# Altium schematic sheet Sheet_1_2025-08-10.schdoc
size 307 x 219 mm
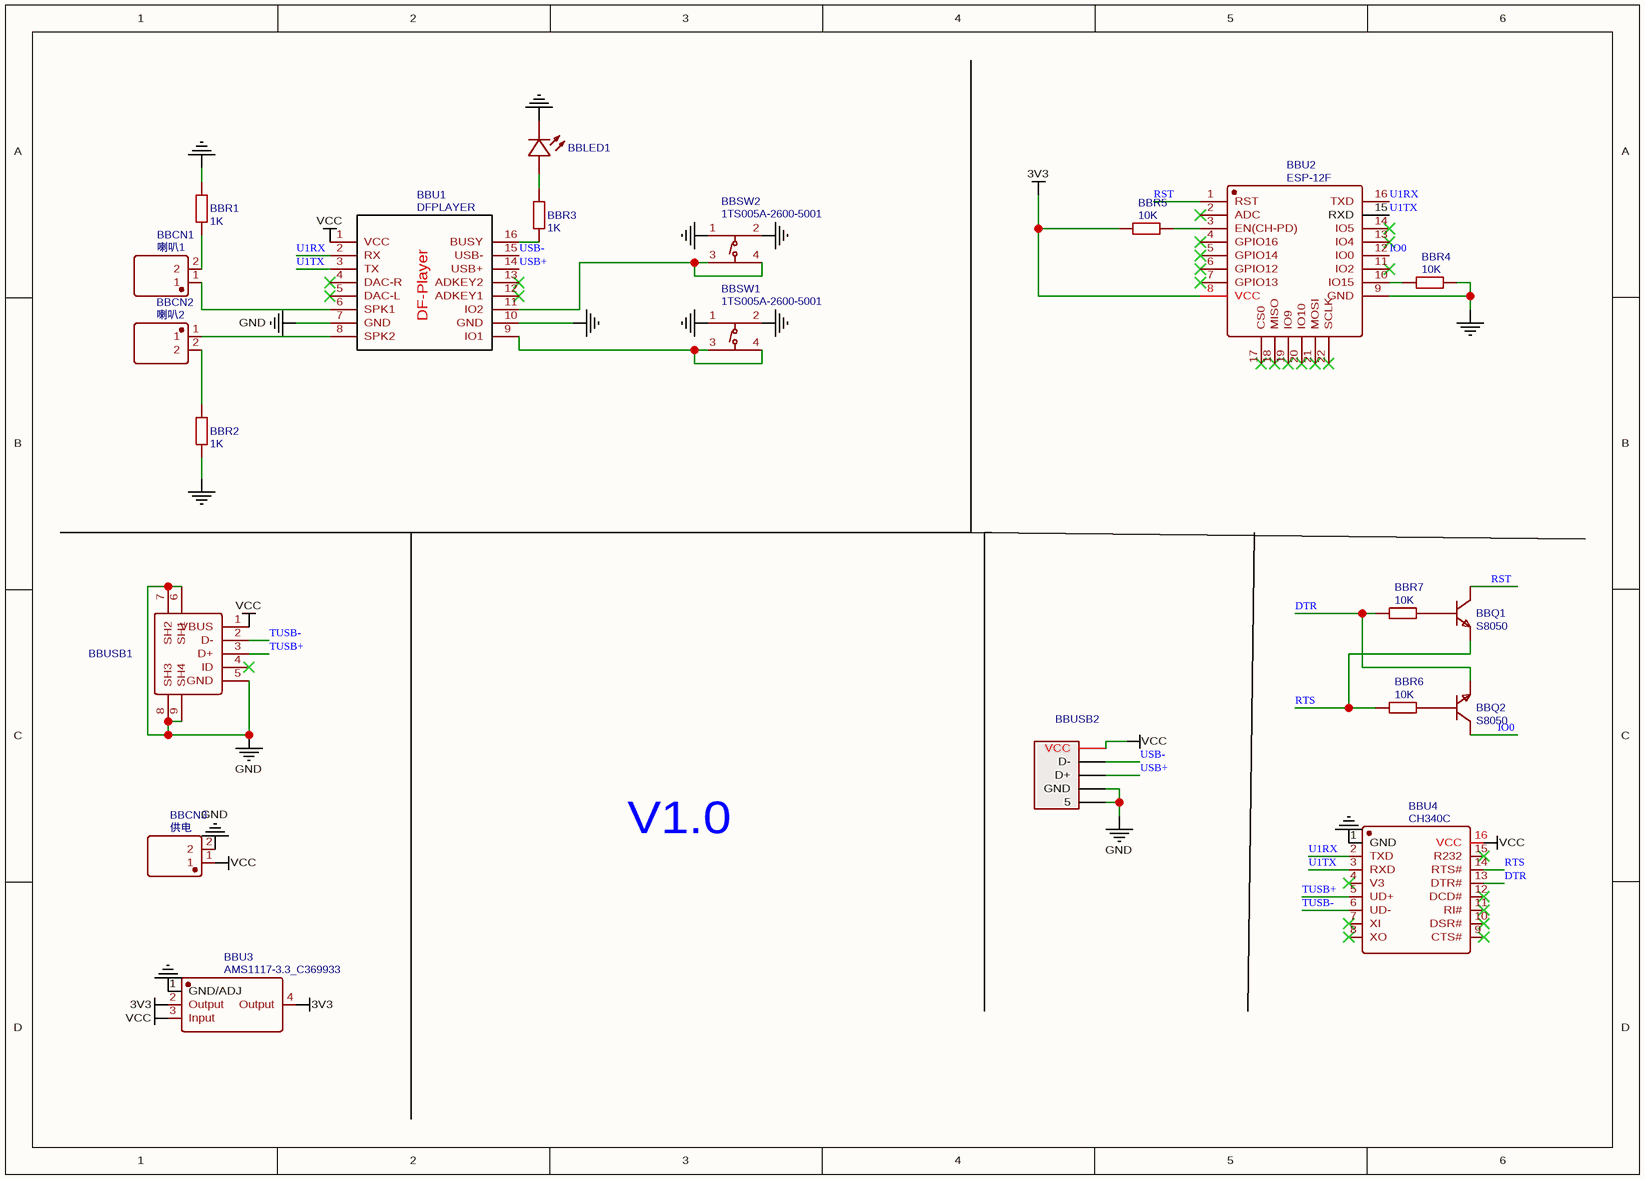
[diagram p0: Sheet_1_2025-08-10.schdoc]

## Parts
BBCN1  喇叭1  [XH2.54-2AW]
BBCN2  喇叭2  [XH2.54-2AW]
BBCN3  供电  [XH2.54-2AW]
BBLED1  FC-2012WBY-460G  [LED0805-RD]  (value not drawn)
BBQ1  S8050  [SOT-23-3_L2.9-W1.3-P1.90-LS2.4-BR]
BBQ2  S8050  [SOT-23-3_L2.9-W1.3-P1.90-LS2.4-BR]
BBR1  1K  [R0805]
BBR2  1K  [R0805]
BBR3  1K  [R0805]
BBR4  10K  [R0805]
BBR5  10K  [R0805]
BBR6  10K  [R0805]
BBR7  10K  [R0805]
BBSW1  1TS005A-2600-5001  [SW-TH_4P-L6.0-W6.0-P4.50-LS6.5]
BBSW2  1TS005A-2600-5001  [SW-TH_4P-L6.0-W6.0-P4.50-LS6.5]
BBU1  DFPLAYER  [DFPLAYER]
BBU2  ESP-12F  [ESP12F简版]
BBU3  AMS1117-3.3_C369933  [SOT-223-4_L6.5-W3.5-P2.30-LS7.0-BR]
BBU4  CH340C  [SOP-16_L10.0-W3.9-P1.27-LS6.0-BL]
BBUSB1  MICROQTJ  [MICRO-USB-SMD_MICROQTJ]  (value not drawn)
BBUSB2  YJ-USB-AF-SMT-01  [USB-A-SMD_FUS270-FSBW5K]  (value not drawn)

## Nets
3V3: BBR5.1 BBU2.8(VCC) BBU3.2(Output) BBU3.4(Output)
GND: BBCN3.2 BBLED1.1(-) BBR1.2 BBR2.2 BBR4.2 BBSW1.1 BBSW1.2 BBSW2.1 BBSW2.2 BBU1.7(GND) BBU1.10(GND) BBU2.9(GND) BBU3.1(GND/ADJ) BBU4.1(GND) BBUSB1.5(GND) BBUSB1.6(SH1) BBUSB1.7(SH2) BBUSB1.8(SH3) BBUSB1.9(SH4) BBUSB2.4(GND) BBUSB2.5
VCC: BBCN3.1 BBU1.1(VCC) BBU3.3(Input) BBU4.16(VCC) BBUSB1.1(VBUS) BBUSB2.1(VCC)
DTR: BBQ2.2(E) BBR7.1 BBU4.13(DTR#)
IO0: BBQ2.3(C) BBU2.12(IO0)
RST: BBQ1.3(C) BBU2.1(RST)
RTS: BBQ1.2(E) BBR6.1 BBU4.14(RTS#)
TUSB+: BBU4.5(UD+) BBUSB1.3(D+)
TUSB-: BBU4.6(UD-) BBUSB1.2(D-)
U1RX: BBU1.2(RX) BBU2.16(TXD) BBU4.2(TXD)
U1TX: BBU1.3(TX) BBU2.15(RXD) BBU4.3(RXD)
USB+: BBU1.14(USB+) BBUSB2.3(D+)
USB-: BBU1.15(USB-) BBUSB2.2(D-)
NetBBCN1_1: BBCN1.1 BBU1.6(SPK1)
NetBBCN1_2: BBCN1.2 BBR1.1
NetBBCN2_1: BBCN2.1 BBU1.8(SPK2)
NetBBCN2_2: BBCN2.2 BBR2.1
NetBBLED1_2: BBLED1.2(+) BBR3.2
NetBBQ1_1: BBQ1.1(B) BBR7.2
NetBBQ2_1: BBQ2.1(B) BBR6.2
NetBBR3_1: BBR3.1 BBU1.16(BUSY)
NetBBR4_1: BBR4.1 BBU2.10(IO15)
NetBBR5_2: BBR5.2 BBU2.3(EN(CH-PD))
NetBBSW1_3: BBSW1.3 BBSW1.4 BBU1.9(IO1)
NetBBSW2_3: BBSW2.3 BBSW2.4 BBU1.11(IO2)

Not connected (* = marked no-connect by the designer): BBU1 4(DAC-R)* 5(DAC-L)* 12(ADKEY1)* 13(ADKEY2)*; BBU2 2(ADC)* 4(GPIO16)* 5(GPIO14)* 6(GPIO12)* 7(GPIO13)* 11(IO2)* 13(IO4)* 14(IO5)* 17(CS0)* 18(MISO)* 19(IO9)* 20(IO10)* 21(MOSI)* 22(SCLK)*; BBU4 4(V3)* 7(XI)* 8(XO)* 9(CTS#)* 10(DSR#)* 11(RI#)* 12(DCD#)* 15(R232)*; BBUSB1 4(ID)*

## Notes on the sheet
- V1.0
- (in symbol DFPLAYER) DF-Player

## Library data of the parts
BBCN1 = 喇叭1: Manufacturer: Boom Precision Elec; Contributor: LCSC; Supplier: LCSC; Supplier Part: C146113; Manufacturer Part: -; spicePre: C; spiceSymbolName: XH-2AW M
BBCN2 = 喇叭2: Manufacturer: Boom Precision Elec; Contributor: LCSC; Supplier: LCSC; Supplier Part: C146113; Manufacturer Part: -; spicePre: C; spiceSymbolName: XH-2AW M
BBCN3 = 供电: Manufacturer: Boom Precision Elec; Contributor: LCSC; Supplier: LCSC; Supplier Part: C146113; Manufacturer Part: -; spicePre: C; spiceSymbolName: XH-2AW M
BBLED1 = FC-2012WBY-460G: Manufacturer: NATIONSTAR; SMT Type: Extend; Supplier: LCSC; Manufacturer Part: FC-2012WBY-460G; Supplier Part: C110099; LCSC Assembly: Yes; spicePre: L; spiceSymbolName: FC-2012WBY-460G
BBQ1 BBQ2 = S8050: Manufacturer: Yenji; Contributor: 立创EDA官方封装库; SMT Type: Extend; Supplier: LCSC; Manufacturer Part: S8050; Supplier Part: C139514; LCSC Assembly: Yes; spicePre: Q; spiceSymbolName: S8050-C139514
BBR1-BBR3 = 1K: Manufacturer: LIZ Elec; Manufacturer Part: CR0805J80102G; nameAlias: Resistance (Ohms); Contributor: LCSC; Supplier: LCSC; Supplier Part: C101925; spicePre: R; spiceSymbolName: CR0805J80102G
BBR4-BBR7 = 10K: Manufacturer: Stackpole Elec; Manufacturer Part: RMCF0603JT10K0; nameAlias: Resistance (Ohms); Contributor: LCSC; Supplier: LCSC; Supplier Part: C238881; spicePre: R; spiceSymbolName: RMCF0603JT10K0
BBSW1 BBSW2 = 1TS005A-2600-5001: Manufacturer: HYP; Contributor: LCSC; Supplier: LCSC; Supplier Part: C319407; Manufacturer Part: 1TS005A-2600-5001; spicePre: S; spiceSymbolName: 1TS005A-2600-5001
BBU1 = DFPLAYER: Contributor: walter471114; Manufacturer Part: DFPLAYER; spicePre: U; spiceSymbolName: DFPLAYER
BBU2 = ESP-12F: Manufacturer: Ai-Thinker; Manufacturer Part: ESP-12F(ESP8266MOD); Supplier: LCSC; Supplier Part: C82891; spicePre: U; spiceSymbolName: ESP-12F(ESP8266MOD)
BBU3 = AMS1117-3.3_C369933: Manufacturer: KEXIN; Contributor: LCSC; Supplier: LCSC; Supplier Part: C369933; Manufacturer Part: AMS1117-3.3; spicePre: U; spiceSymbolName: AMS1117-3.3_C369933
BBU4 = CH340C: Manufacturer: WCH; Supplier: LCSC; Manufacturer Part: CH340C; Supplier Part: C84681; spicePre: U; spiceSymbolName: CH340C
BBUSB1 = MICROQTJ: Manufacturer: SHOU HAN; Contributor: LCSC; Supplier: LCSC; Supplier Part: C404968; Manufacturer Part: MicroQTJ; spicePre: U; spiceSymbolName: MICROQTJ
BBUSB2 = YJ-USB-AF-SMT-01: Manufacturer: ValuePro; Supplier: LCSC; Manufacturer Part: YJ-USB-AF-SMT-01; image: //image.lceda.cn/szlcsc/C8328.jpg; Supplier Part: C8328; spicePre: U; spiceSymbolName: YJ-USB-AF-SMT-01